# EAGLE design ButtonsMiniBoard (EAGLE 9.6.2)
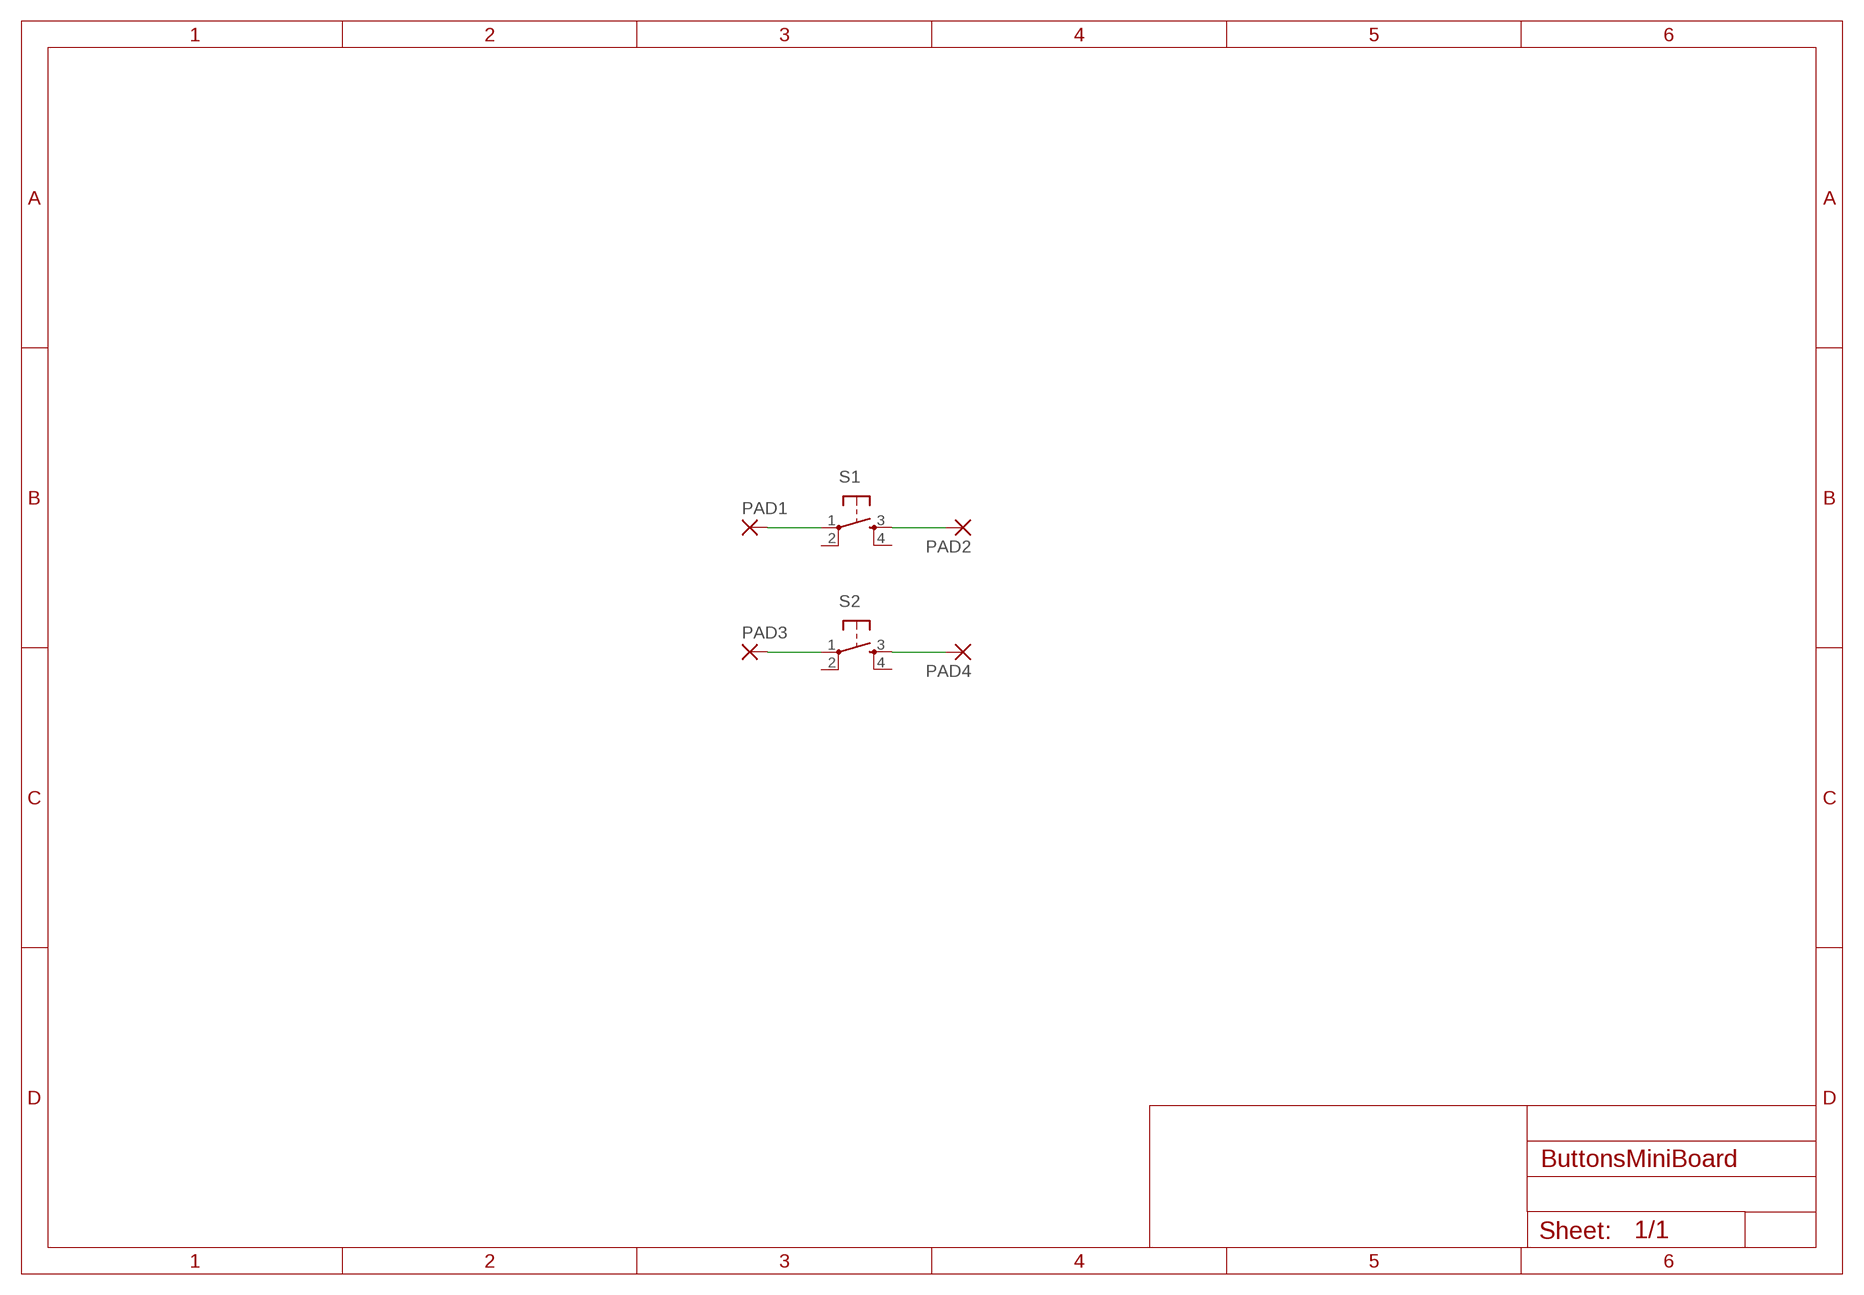
[diagram p0: schematic, sheet 1]

## Parts
PAD1  2,15/1,0  [2,15/1,0]
PAD2  2,15/1,0  [2,15/1,0]
PAD3  2,15/1,0  [2,15/1,0]
PAD4  2,15/1,0  [2,15/1,0]
S1  TAC_SWITCHPTH  [TACTILE-PTH]
S2  TAC_SWITCHPTH  [TACTILE-PTH]

## Nets
N$1: PAD1.1(P) S1.1
N$2: PAD2.1(P) S1.3
N$3: PAD3.1(P) S2.1
N$4: PAD4.1(P) S2.3
Unconnected: S1.2 S1.4 S2.2 S2.4

## Library data of the parts
PAD1-PAD4 = wirepad:2,15/1,0: THROUGH-HOLE PAD
S1 S2 = ShopParts:TAC_SWITCH: Momentary Switch Button commonly used for reset or general input. Spark Fun Electronics SKU : COM-00097 SMT- SWCH-08247

## Board
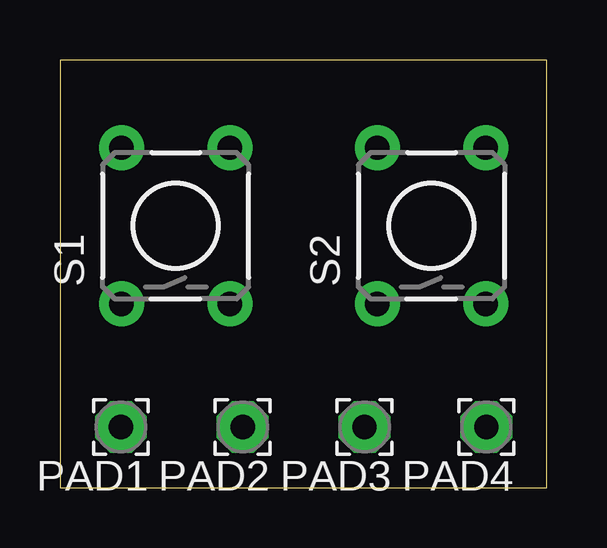
[diagram p1: board, top side]
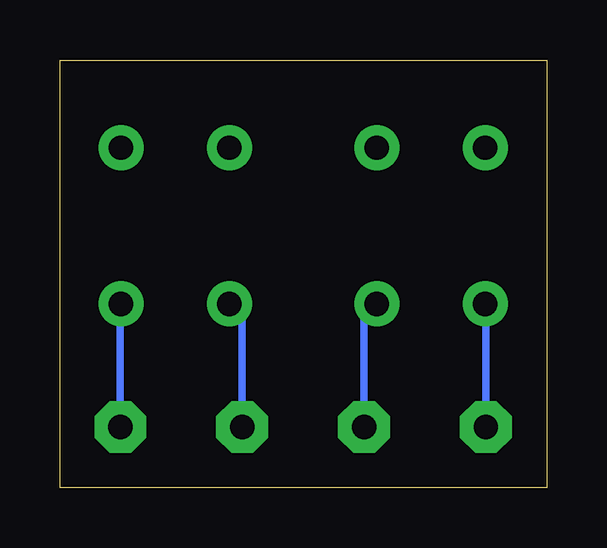
[diagram p2: board, bottom side, seen from below]

Size 20.3 x 17.83 mm. Coordinates in mm from the lower left corner, seen from the top.
Outline: 0,0 20.3,0 20.3,17.83 0,17.83 0,0
Copper layers (1*16): Top 0.035mm / dielectric 1.5mm / Bottom 0.035mm
Design rules "elcdrc": minimum track width 12mil, minimum drill 0.3mm, track to track 12mil, track to pad 12mil, pad to pad 12mil, via to via 12mil, smd to smd 6mil, copper to edge 12mil, drill to drill 12mil, minimum pad ring 10mil, minimum via ring 8mil, stop-mask expansion 4mil, vias tented up to drill 0mil, thermal gap 10mil

### Footprints (pad centres in the part's own frame; a part is rotated, then mirrored left to right if it is on the bottom)
2,15/1,0 = drill 1.016 pad 2.159 octagon: 1 0,0
TACTILE-PTH = drill 1.016 pad 1.88: 1 -3.251,2.261; 2 3.251,2.261; 3 -3.251,-2.261; 4 3.251,-2.261

### Placement (x,y rotation side)
PAD1  2.54,2.54 180 top
PAD2  7.62,2.54 180 top
PAD3  12.7,2.54 180 top
PAD4  17.78,2.54 180 top
S1  4.83,10.92 90 top
S2  15.49,10.92 90 top

### Tracks (layer width: path | path; a pad name or v marks a point on that pad's centre or on a via)
N$1
  Bottom 0.305: PAD1.1 2.54,7.64 S1.1
N$2
  Bottom 0.305: PAD2.1 7.62,7.14 S1.3
N$3
  Bottom 0.305: PAD3.1 12.7,7.14 S2.1
N$4
  Bottom 0.305: PAD4.1 17.78,7.64 S2.3